# EAGLE design fsr_electrode (EAGLE 9.4.2)
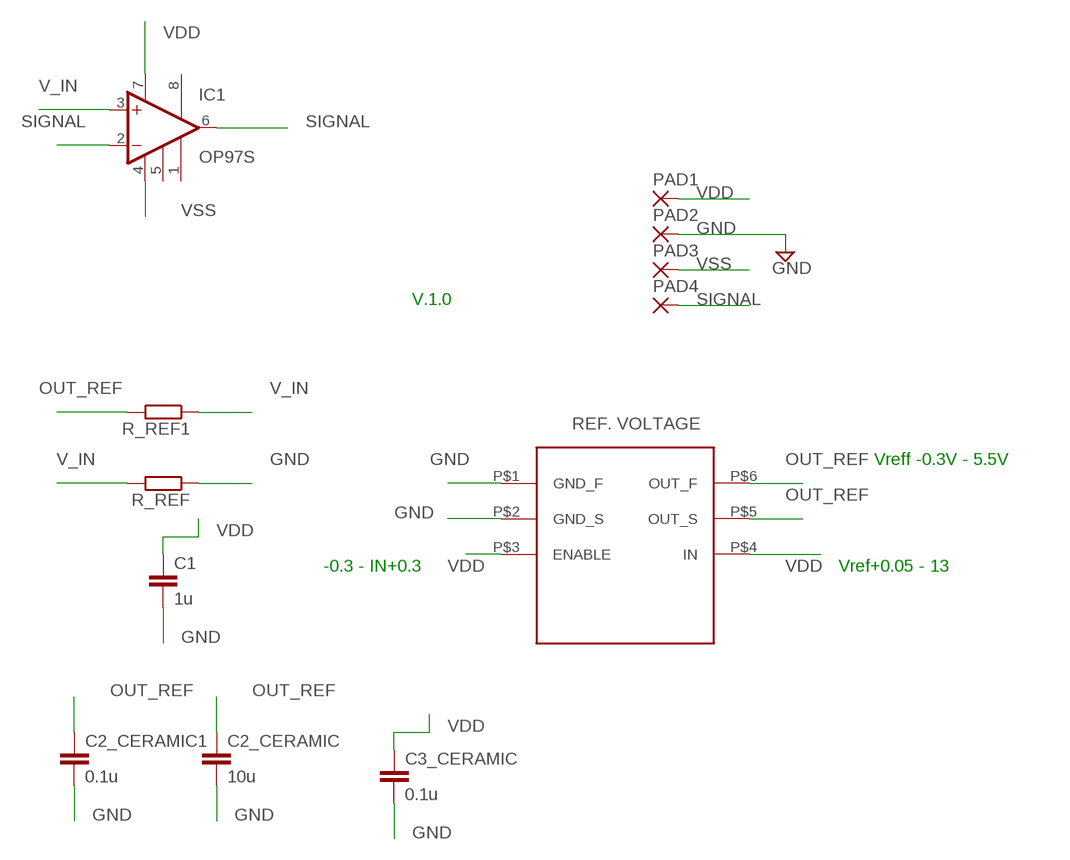
[diagram p0: schematic, sheet 1]

## Parts
C1  1u  C-EUC0805  [C0805]
C2_CERAMIC  10u  C-EUC0805  [C0805]
C2_CERAMIC1  0.1u  C-EUC0805  [C0805]
C3_CERAMIC  0.1u  C-EUC0805  [C0805]
IC1  OP97S  [SO08]
PAD1  SMD5  [SMD2,54-5,08]
PAD2  SMD5  [SMD2,54-5,08]
PAD3  SMD5  [SMD2,54-5,08]
PAD4  SMD5  [SMD2,54-5,08]
R_REF  10k  R-EU_M0805  [M0805]
R_REF1  10k  R-EU_M0805  [M0805]
REF3450  REF3450IDBVR  [UZUN]

## Nets
GND: C1.2 C2_CERAMIC1.2 C2_CERAMIC.2 C3_CERAMIC.2 PAD2.1(P) R_REF.1 REF3450.P$1(GND_F) REF3450.P$2(GND_S)
OUT_REF: C2_CERAMIC1.1 C2_CERAMIC.1 R_REF1.2 REF3450.P$5(OUT_S) REF3450.P$6(OUT_F)
SIGNAL: IC1.2(-IN) IC1.6(OUT) PAD4.1(P)
V_IN: IC1.3(+IN) R_REF1.1 R_REF.2
VDD: C1.1 C3_CERAMIC.1 IC1.7(V+) PAD1.1(P) REF3450.P$3(ENABLE) REF3450.P$4(IN)
VSS: IC1.4(V-) PAD3.1(P)
Unconnected: IC1.1(BAL1) IC1.5(COMP) IC1.8(BAL2)

## Notes on the sheet
- V.1.0
- Vreff -0.3V - 5.5V
- -0.3 - IN+0.3 | Vref+0.05 - 13

## Library data of the parts
C1 C2_CERAMIC C2_CERAMIC1 C3_CERAMIC = rcl:C-EU: CAPACITOR, European symbol; SPICEPREFIX: C
IC1 = linear:OP97: Low Power, High Precision Operational Amplifier Source: http://www.analog.com/static/imported-files/data_sheets/OP97.pdf
PAD1-PAD4 = wirepad:SMD5: SMD PAD
R_REF R_REF1 = rcl:R-EU_: RESISTOR, European symbol; SPICEPREFIX: R
REF3450 = Spannungsreferenzen:REF3450IDBVR

## Board
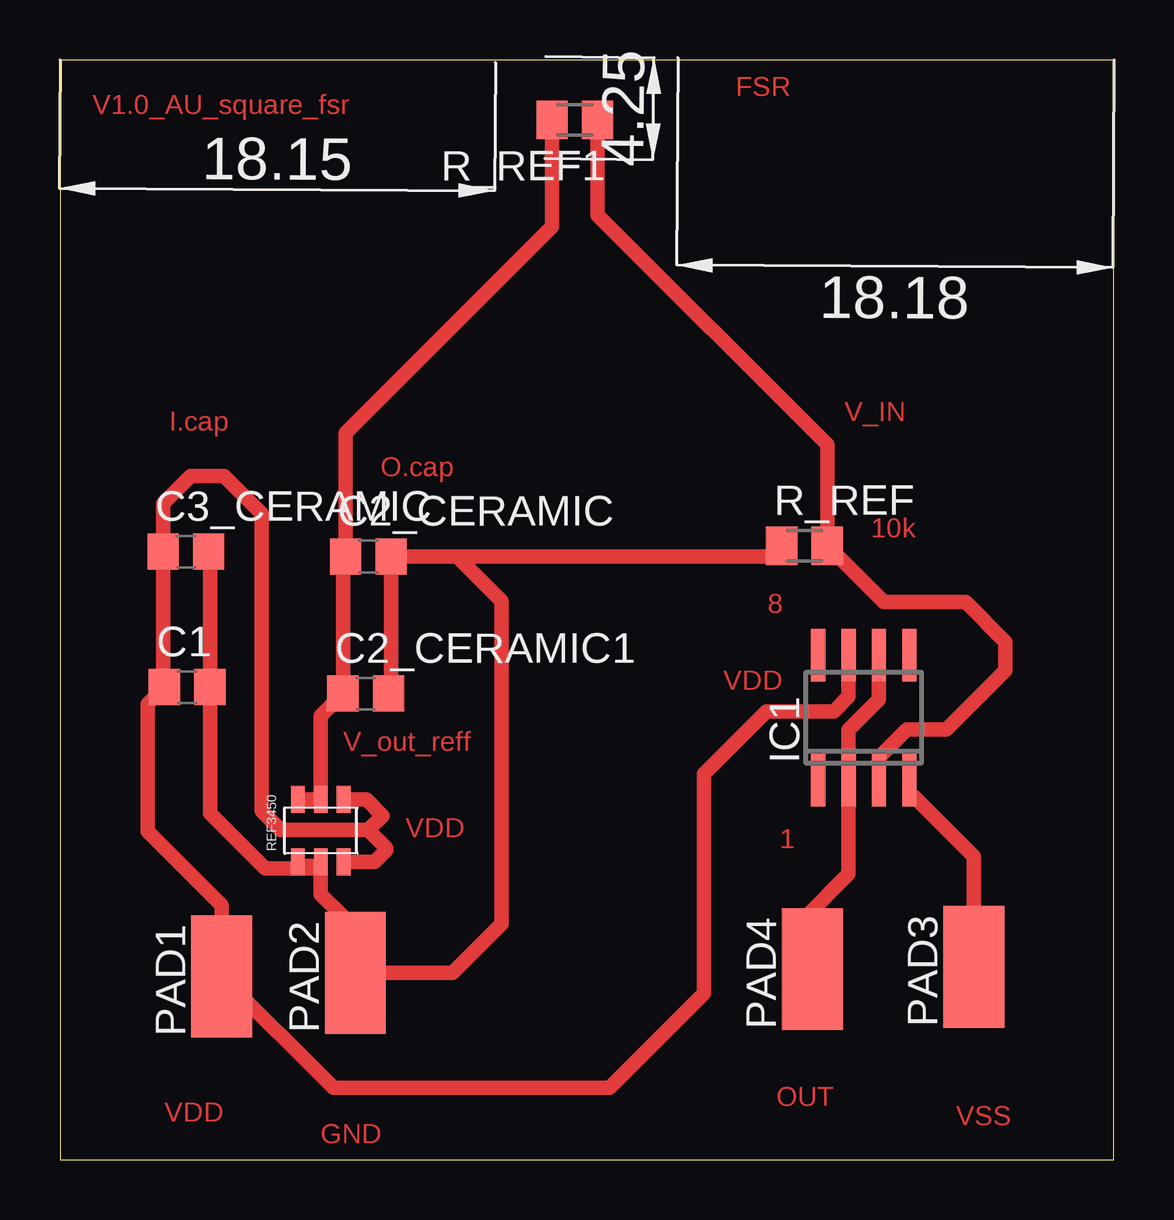
[diagram p1: board, top side]

Size 43.93 x 45.85 mm. Coordinates in mm from the lower left corner, seen from the top.
Outline: 0,0 43.93,0 43.93,45.85 0,45.85 0,0
Copper layers (1*16): Top 0.035mm / dielectric 1.5mm / Bottom 0.035mm
Design rules "TM_medit_aetzen": minimum track width 10mil, minimum drill 8mil, track to track 10mil, track to pad 10mil, pad to pad 10mil, via to via 15mil, smd to smd 8mil, copper to edge 40mil, drill to drill 8mil, minimum pad ring 10mil, minimum via ring 8mil, stop-mask expansion 4mil, vias tented up to drill 0mil, thermal gap 10mil

### Footprints (pad centres in the part's own frame; a part is rotated, then mirrored left to right if it is on the bottom)
C0805 = smd 1.3 x 1.5: 1 -0.95,0; 2 0.95,0
SO08 = smd 0.6 x 2.2: 1 -1.905,-2.6; 2 -0.635,-2.6; 3 0.635,-2.6; 4 1.905,-2.6; 5 1.905,2.6; 6 0.635,2.6; 7 -0.635,2.6; 8 -1.905,2.6
SMD2,54-5,08 = smd 2.54 x 5.08: 1 0,0
M0805 = smd 1.3 x 1.6: 1 -0.95,0; 2 0.95,0
UZUN = smd 1.1 x 0.6: P$1 0,0; P$2 0,-0.95; P$3 0,-1.9; P$4 2.6,-1.9; P$5 2.6,-0.95; P$6 2.6,0

### Placement (x,y rotation side)
C1  5.3,19.7 0 top
C2_CERAMIC  12.85,25.15 0 top
C2_CERAMIC1  12.74,19.43 0 top
C3_CERAMIC  5.25,25.35 0 top
IC1  33.5,18.43 0 top
PAD1  6.74,7.65 0 top
PAD2  12.31,7.8 0 top
PAD3  38.09,8.05 0 top
PAD4  31.36,7.95 0 top
R_REF  31.03,25.6 0 top
R_REF1  21.46,43.35 180 top
REF3450  9.92,12.42 90 top

### Tracks (layer width: path | path; a pad name or v marks a point on that pad's centre or on a via)
GND
  Top 0.254: 10.6,12.15 10.2,12.15 REF3450.P$1 REF3450.P$2 | PAD2.1 11.75,8.37 11.75,10.2
  Top 0.61: C3_CERAMIC.2 6.25,25.3 C1.2 6.25,14.45 8.55,12.15 10.6,12.15 REF3450.P$2 10.87,11.08 11.75,10.2 | 16.55,25.16 C2_CERAMIC.2 13.8,19.55 C2_CERAMIC1.2 | 16.55,25.16 29.63,25.16 R_REF.1 | PAD2.1 16.36,7.8 18.4,9.85 18.4,23.3 16.55,25.16
OUT_REF
  Top 0.61: REF3450.P$6 REF3450.P$5 10.87,18.52 C2_CERAMIC1.1 11.79,25.05 C2_CERAMIC.1 11.9,30.3 20.51,38.91 R_REF1.2
SIGNAL
  Top 0.254: 31.05,10.1 31.36,9.79 PAD4.1
  Top 0.61: 31.05,10.1 32.87,11.92 32.87,13.75 IC1.2 32.87,17.92 34.14,19.19 IC1.6
V_IN
  Top 0.61: R_REF1.1 22.41,39.39 31.98,29.82 R_REF.2 34.34,23.25 37.75,23.25 39.4,21.6 39.4,20.4 36.95,17.95 35.3,17.95 34.14,16.79 IC1.3
VDD
  Top 0.61: IC1.7 32.87,19.32 32.25,18.7 29.45,18.7 26.85,16.1 26.85,6.95 22.9,3 11.4,3 PAD1.1 6.74,10.61 3.65,13.7 3.65,19 C1.1 4.3,19.75 C3_CERAMIC.1 4.3,27.35 5.45,28.5 6.85,28.5 8.4,26.95 8.4,14.55 9.2,13.75 12.85,13.75 | 12.85,13.75 13.45,14.35 12.78,15.03 REF3450.P$4 | 12.85,13.75 13.6,13 13.6,12.9 13.12,12.43 REF3450.P$3
VSS
  Top 0.254: IC1.4 35.41,15.34 35.6,15.15
  Top 0.61: PAD3.1 38.09,12.66 35.6,15.15

### Text on the board
Top: V1.0_AU_square_fsr | FSR | V_IN | I.cap | O.cap | 10k | 8 | VDD | V_out_reff | VDD | 1 | VDD | OUT | GND | VSS